# Altium schematic sheet AmplificadorNMOS.SchDoc
size A4; SheetNumber: 1; SheetTotal: 1
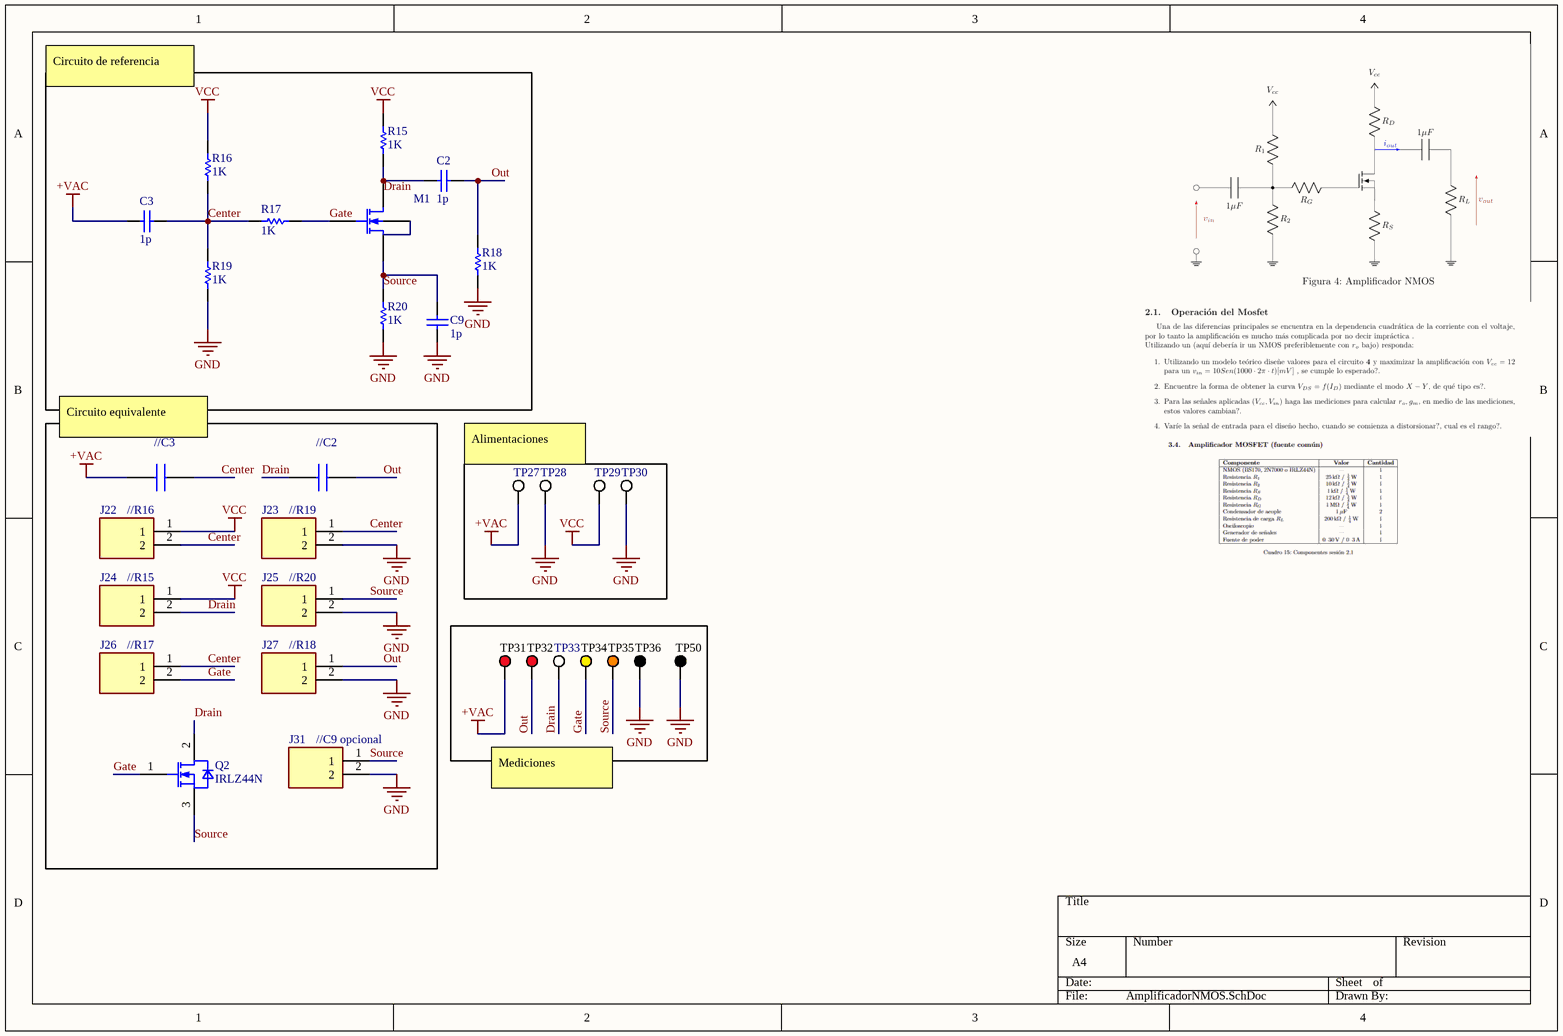
[diagram p0: AmplificadorNMOS.SchDoc]

## Parts
C2  value 1p  (hidden comment: Capacitor)
C3  value 1p  (hidden comment: Capacitor)
C4  C1206C105K3RAC7800  [CAPC3216X140N]  (value not drawn)
C5  C1206C105K3RAC7800  [CAPC3216X140N]  (value not drawn)
C9  value 1p  (hidden comment: Capacitor)
J22  D01-9970242  [D019970242]  (value not drawn)
J23  D01-9970242  [D019970242]  (value not drawn)
J24  D01-9970242  [D019970242]  (value not drawn)
J25  D01-9970242  [D019970242]  (value not drawn)
J26  D01-9970242  [D019970242]  (value not drawn)
J27  D01-9970242  [D019970242]  (value not drawn)
J31  D01-9970242  [D019970242]  (value not drawn)
M1  N-channel MOS1 MOSFET Shichman and Hodges Model  (value not drawn)
Q2  IRLZ44N  [IFX-PG-TO220-3-904-1]
R15  value 1K  (hidden comment: Resistor)
R16  value 1K  (hidden comment: Resistor)
R17  value 1K  (hidden comment: Resistor)
R18  value 1K  (hidden comment: Resistor)
R19  value 1K  (hidden comment: Resistor)
R20  value 1K  (hidden comment: Resistor)
TP27  575-4  [KSTN-575-4]  (value not drawn)
TP28  575-4  [KSTN-575-4]  (value not drawn)
TP29  575-4  [KSTN-575-4]  (value not drawn)
TP30  575-4  [KSTN-575-4]  (value not drawn)
TP31  5010  [KSTN-5010_V]  (value not drawn)
TP32  5010  [KSTN-5010_V]  (value not drawn)
TP33  5012  [KSTN-5012_V]  (value not drawn)
TP34  5014  [KSTN-5014_V]  (value not drawn)
TP35  5013  [KSTN-5013_V]  (value not drawn)
TP36  5011  [KSTN-5011_V]  (value not drawn)
TP50  5011  [KSTN-5011_V]  (value not drawn)

## Nets
+VAC: C3.1 C4.1 TP27.1 TP31.1
GND: C9.2 J23.2 J25.2 J27.2 J31.2 R18.1 R19.2 R20.2 TP28.1 TP30.1 TP36.1 TP50.1
VCC: J22.1 J24.1 R15.1 R16.1 TP29.1
Center: C3.2 C4.2 J22.2 J23.1 J26.1 R16.2 R17.1 R19.1
Drain: C5.1 J24.2 Q2.2(DRAIN) TP33.1
Gate: J26.2 M1.2(G) Q2.1(GATE) R17.2 TP34.1
Out: C2.2 C5.2 J27.1 R18.2 TP32.1
Source: C9.1 J25.1 J31.1 M1.3(S) Q2.3(SOURCE) R20.1 TP35.1
NetC2_1: C2.1 M1.1(D) R15.2

Not connected (* = marked no-connect by the designer): M1 4(B)

## Notes on the sheet
- Circuito de referencia
- (near C4) Circuito equivalente
- (near C4) //C3
- (near C5) //C2
- (near J22) //R16
- (near J23) //R19
- Alimentaciones
- (near J24) //R15
- (near J25) //R20
- (near J26) //R17
- (near J27) //R18
- (near J31) //C9 opcional
- Mediciones
- Labels drawn without touching a wire or pin: Drain

## Library data of the parts
C2 C3 C9 = Capacitor: SimulationGenericComponent: True
C4 C5 = C1206C105K3RAC7800: Multilayer Ceramic Capacitors MLCC - SMD/SMT 25V 1uF X7R 1206 10%; Manufacturer_Name: Yageo Group; Geometry.Height: 1.4mm; Mouser Part Number: 80-C1206C105K3R7800; Mouser Price/Stock: https://www.mouser.co.uk/ProductDetail/KEMET/C1206C105K3RAC7800?qs=9Bh1%2FLvCqWR5qBTiXKKjKA%3D%3D; Manufacturer_Part_Number: C1206C105K3RAC7800; Datasheet Link: https://connect.kemet.com:7667/gateway/IntelliData-ComponentDocumentation/1.0/download/specsheet/C1206C105K3RACTU
J22-J27 J31 = D01-9970242: IC Socket: 2 Pos Receptacle SIL Straight THT Strip; Manufacturer_Name: Harwin; Geometry.Height: 4.2mm; Mouser Part Number: 855-D01-9970242; Mouser Price/Stock: https://www.mouser.co.uk/ProductDetail/Harwin/D01-9970242?qs=TpUtqFO9vU%252Bf37OJ5TYoTQ%3D%3D; Manufacturer_Part_Number: D01-9970242; Datasheet Link: https://content.harwin.com/m/e0b6c35948424a73/original/DRG-00097-Technical-Drawing-Datasheet-D01-997-pdf.pdf
M1 = MOSFET N-ch Lev1: CBD: 0; FC: 0.5; IS: 1e-14; KP: 2e-05; PB: 0.8; PHI: 0.6; TNOM: 27; SimulationGenericComponent: True; CBS: 0; CGBO: 0; CGDO: 0; CGSO: 0; CJ: 0; CJSW: 0; GAMMA: 0; JS: 0; LAMBDA: 0; LD: 0; MJ: 0.5; MJSW: 0.5; NSS: 0; NSUB: 0; RD: 0; RS: 0; RSH: 0; TOX: 0; TPG: 0; U0: 0; VTO: 0
Q2 = IRLZ44N: OptiMOS 3 Power-Transistor, VDS 100V; Manufacturer: Infineon Technologies; Manufacturer Order Number: IRLZ44N; PackageReference: PG-TO220-3-904
R15-R20 = Resistor: TC1: 0; SimulationGenericComponent: True; TC2: 0
TP27-TP30 = CMP-2000-05649-1: Banana Jack, Non-Insulated, 1-Pin THD, RoHS, Bulk; Manufacturer: Keystone-Electronics; Package Version: Rev. B, 11/1994; Plug/Mating Plug Diameter: StandardBanana; Gender: Female; Package Reference: 575-4; Operating Temperature: -; Contact Material: Brass; Packaging: Bulk; Series: -; Category: Connectors,Interconnects; Color: -; Type: BananaJack; Contact Finish: Nickel; Features: -; Family: BananaandTipConnectors-Jacks,Plugs; Body Material: -; Manufacturer URL: http://www.keyelco.com/; Termination: Solder; Insulation: Non-Insulated; Datasheet Version: Rev. B, 11/1994; Mounting Technology: ThroughHole; Package URL: http://www.keyelco.com/product-pdf.cfm?p=2379; Mounting Type: ThroughHole; Package Description: 1-Pin Through Hole Device, Dia 7.92 mm; Datasheet URL: http://www.keyelco.com/product-pdf.cfm?p=2379; Wire Gauge: -
TP31 TP32 = CMP-1672-00002-4: Test Point, Red, Through Hole, RoHS, Bulk; Manufacturer: Keystone; Contact Material: Bronze; Mounting Technology: Through Hole; RoHSCompliant: true; Pins: 1; Package Quantity: 100; ComponentLink2Description: Datasheet; Height: 8.12 mm; ComponentLink1URL: http://www.keyelco.com/; DatasheetVersion: Rev. F, 12/2013; Mount: Through Hole; PackageReference: 5010; Contact Plating: Silver; Packaging: Bulk; Colour: Red; REACH SVHC: No SVHC; PackageDescription: 1-Pin Through Hole Device, Dia 3.17 mm; ComponentLink2URL: http://www.keyelco.com/product-pdf.cfm?p=1319; ComponentLink1Description: Manufacturer URL
TP33 = CMP-1672-00004-4: Test Point, White, Through Hole, RoHS, Bulk; Manufacturer: Keystone; DatasheetVersion: Rev. F, 12/2013; ComponentLink1URL: http://www.keyelco.com/; PackageReference: 5012; RoHSCompliant: true; ComponentLink2Description: Datasheet; Colour: White; Contact Material: Bronze; PackageDescription: 1-Pin Through Hole Device, Dia 3.17 mm; Mounting Technology: Through Hole; Mount: Through Hole; Package Quantity: 100; ComponentLink1Description: Manufacturer URL; Pins: 1; Height: 8.12 mm; Packaging: Bulk; REACH SVHC: No SVHC; Contact Plating: Silver; Length: 11.3 mm; ComponentLink2URL: http://www.keyelco.com/product-pdf.cfm?p=1321
TP34 = CMP-1672-00006-4: Test Point, Yellow, Through Hole, RoHS, Bulk; Manufacturer: Keystone; PackageDescription: 1-Pin Through Hole Device, Dia 3.17 mm; REACH SVHC: No SVHC; ComponentLink2Description: Datasheet; ComponentLink2URL: http://www.keyelco.com/product-pdf.cfm?p=1323; Package Quantity: 100; Colour: Yellow; Height: 8.12 mm; RoHSCompliant: true; Contact Material: Bronze; Mount: Through Hole; Contact Plating: Silver; ComponentLink1URL: http://www.keyelco.com/; Packaging: Bulk; Mounting Technology: Through Hole; PackageReference: 5014; ComponentLink1Description: Manufacturer URL; DatasheetVersion: Rev. F, 12/2013
TP35 = CMP-1672-00005-4: Test Point, Orange, Through Hole, RoHS, Bulk; Manufacturer: Keystone; REACH SVHC: No SVHC; ComponentLink2Description: Datasheet; PackageDescription: 1-Pin Through Hole Device, Dia 3.17 mm; Package Quantity: 100; PackageReference: 5013; Contact Material: Bronze; DatasheetVersion: Rev. F, 12/2013; ComponentLink2URL: http://www.keyelco.com/product-pdf.cfm?p=1322; Contact Plating: Silver; ComponentLink1URL: http://www.keyelco.com/; Packaging: Bulk; ComponentLink1Description: Manufacturer URL; Colour: Orange; Height: 8.12 mm; RoHSCompliant: True; Mount: Through Hole; Mounting Technology: Through Hole
TP36 TP50 = CMP-1672-00003-4: Test Point, Black, Through Hole, RoHS, Bulk; Manufacturer: Keystone; ComponentLink2URL: http://www.keyelco.com/product-pdf.cfm?p=1320; Colour: Black; Pins: 1; REACH SVHC: No SVHC; ComponentLink1URL: http://www.keyelco.com/; PackageReference: 5011; Contact Plating: Silver; Package Quantity: 100; Packaging: Bulk; RoHSCompliant: true; Height: 8.12 mm; PackageDescription: 1-Pin Through Hole Device, Dia 3.17 mm; Mount: Through Hole; Mounting Technology: Through Hole; DatasheetVersion: Rev. F, 12/2013; ComponentLink1Description: Manufacturer URL; Contact Material: Bronze; ComponentLink2Description: Datasheet